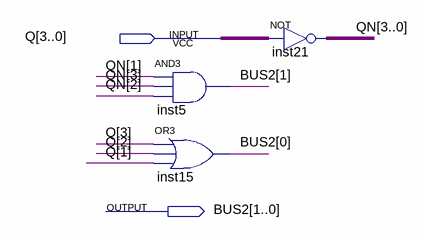
[diagram p0: schematic sheet]
// Quartus schematic bus2.bdf as structural Verilog: 3 symbols, 2 pins
module bus2 (
  input  [3:0] Q,
  output [1:0] BUS2
);

  wire [3:0] QN;

  and inst5 (BUS2[1], QN[1], QN[3], QN[2]);
  or inst15 (BUS2[0], Q[3], Q[2], Q[1]);
  assign QN = ~Q;  // NOT inst21, 4 bits wide
endmodule
